# Altium schematic sheet SOM.SchDoc
size A3; SheetNumber: 8; SheetTotal: 11
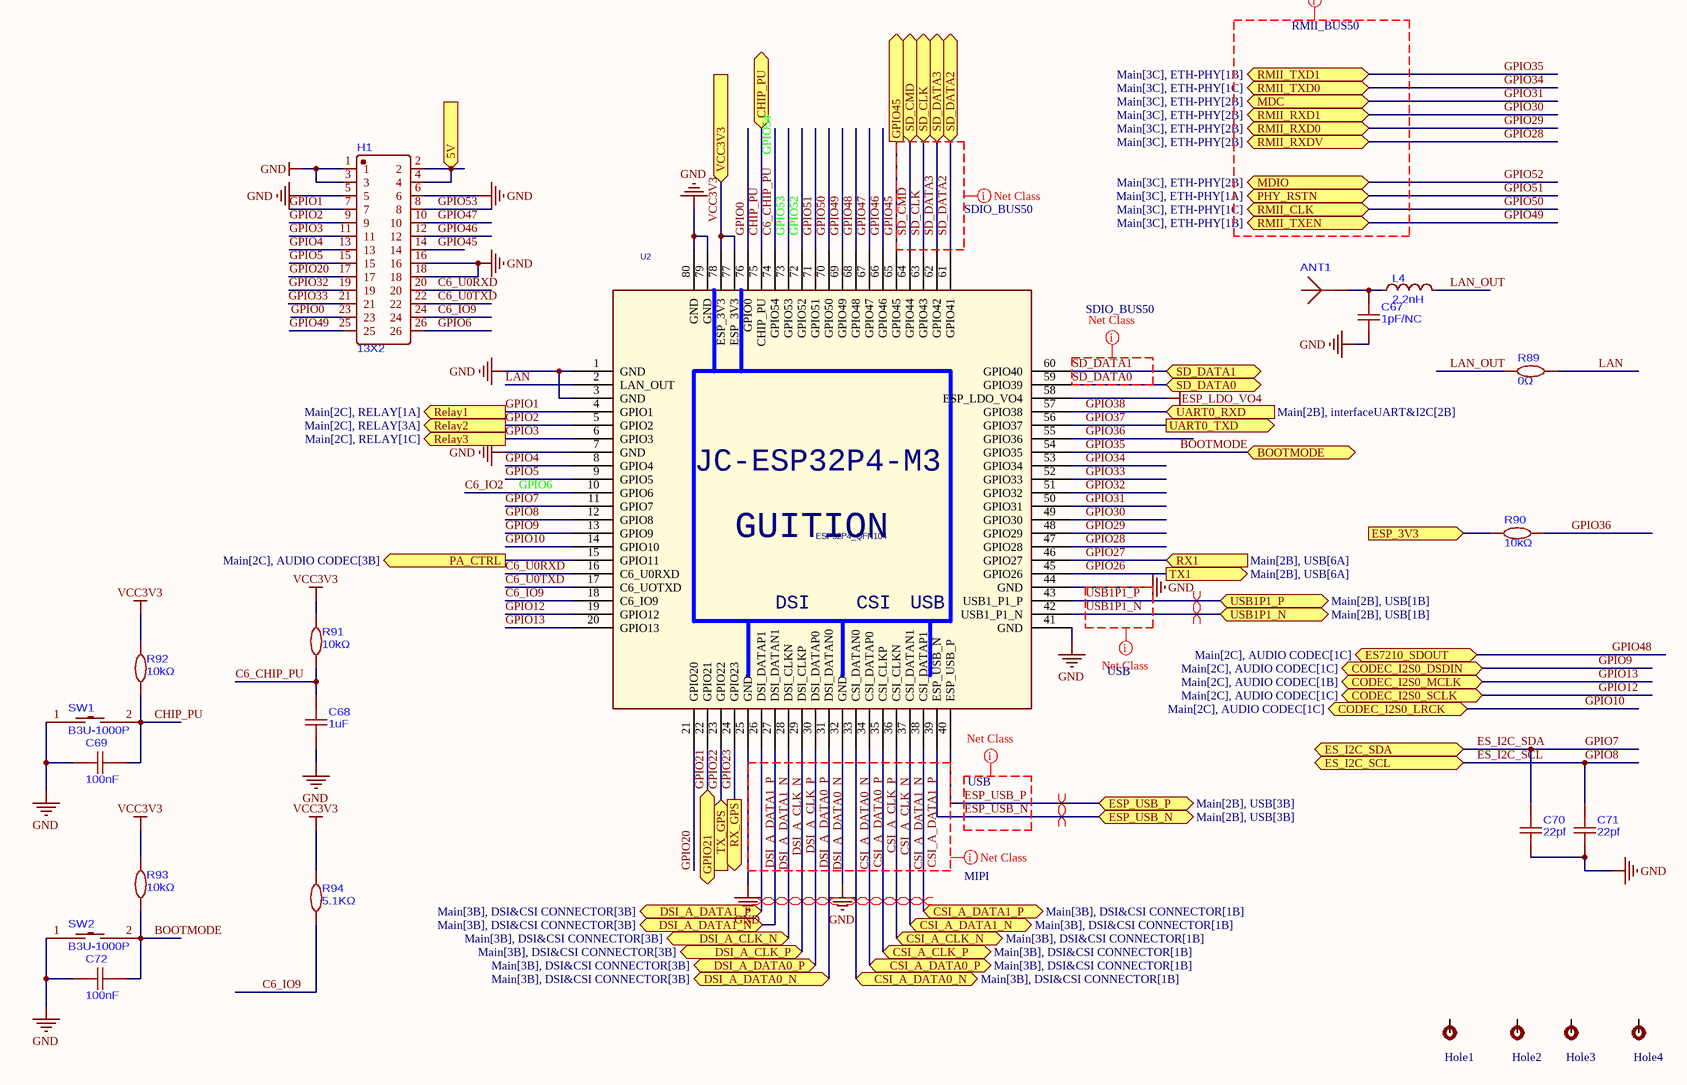
[diagram p0: SOM.SchDoc]

## Parts
ANT1  RF ANT 2450MHz CERAMIC SMD  [ANT-SMD-2_L3.2-W1.6-C504002]  (value not drawn)
C67  1pF/NC  [C0603]
C68  1uF  [C0603]
C69  100nF  [C0603]
C70  22pf  [C0603]
C71  22pf  [C0603]
C72  100nF  [C0603]
H1  13X2  [HDR-TH_26P-P2.54-V-M-R2-C13-S2.54]
Hole1  Pad Big  [Screw 3.0]  (value not drawn)
Hole2  Pad Big  [Screw 3.0]  (value not drawn)
Hole3  Pad Big  [Screw 3.0]  (value not drawn)
Hole4  Pad Big  [Screw 3.0]  (value not drawn)
L4  2.2nH  [C0603]
R89  0Ω  [R0603]
R90  10kΩ  [R0603]
R91  10kΩ  [R0603]
R92  10kΩ  [R0603]
R93  10kΩ  [R0603]
R94  5.1KΩ  [R0603]
SW1  B3U-1000P  [KEY-SMD_B3U-1000PM]
SW2  B3U-1000P  [KEY-SMD_B3U-1000PM]
U2  ESP32P4_QFN104  [JC-ESP32P4-M3_V0.2]

## Ports
5V (in, see Main[2A], interfaceUART&I2C[2B], Power[3C], RELAY[1A], USB[2D]), BOOTMODE (bidir, see Main[2B], USB[5C]), CHIP_PU (bidir, see Main[2B], USB[4C]), CODEC_I2S0_DSDIN (bidir, see Main[2C], AUDIO CODEC[1C]), CODEC_I2S0_LRCK (bidir, see Main[2C], AUDIO CODEC[1C]), CODEC_I2S0_MCLK (bidir, see Main[2C], AUDIO CODEC[1B]), CODEC_I2S0_SCLK (bidir, see Main[2C], AUDIO CODEC[1C]), CSI_A_CLK_N (bidir, see Main[3B], DSI&CSI CONNECTOR[1B]), CSI_A_CLK_P (bidir, see Main[3B], DSI&CSI CONNECTOR[1B]), CSI_A_DATA0_N (bidir, see Main[3B], DSI&CSI CONNECTOR[1B]), CSI_A_DATA0_P (bidir, see Main[3B], DSI&CSI CONNECTOR[1B]), CSI_A_DATA1_N (bidir, see Main[3B], DSI&CSI CONNECTOR[1B]), CSI_A_DATA1_P (bidir, see Main[3B], DSI&CSI CONNECTOR[1B]), DSI_A_CLK_N (bidir, see Main[3B], DSI&CSI CONNECTOR[3B]), DSI_A_CLK_P (bidir, see Main[3B], DSI&CSI CONNECTOR[3B]), DSI_A_DATA0_N (bidir, see Main[3B], DSI&CSI CONNECTOR[3B]), DSI_A_DATA0_P (bidir, see Main[3B], DSI&CSI CONNECTOR[3B]), DSI_A_DATA1_N (bidir, see Main[3B], DSI&CSI CONNECTOR[3B]), DSI_A_DATA1_P (bidir, see Main[3B], DSI&CSI CONNECTOR[3B]), ES7210_SDOUT (bidir, see Main[2C], AUDIO CODEC[1C]), ES_I2C_SCL (bidir, see Main[2B], AUDIO CODEC[1B], DSI&CSI CONNECTOR[2C], interfaceUART&I2C[2C]), ES_I2C_SDA (bidir, see Main[2B], AUDIO CODEC[1A], DSI&CSI CONNECTOR[2C], interfaceUART&I2C[2C]), ESP_3V3 (in, see Main[2A], DSI&CSI CONNECTOR[3C], ETH-PHY[2A], interfaceUART&I2C[1C], Power[4C]), ESP_USB_N (bidir, see Main[2B], USB[3B]), ESP_USB_P (bidir, see Main[2B], USB[3B]), GPIO21 (bidir, see Main[3C], SENSOR[4B]), GPIO45 (out, see Main[3A], MICROSD CARD[1B]), MDC (bidir, see Main[3C], ETH-PHY[2B]), MDIO (bidir, see Main[3C], ETH-PHY[2B]), PA_CTRL (out, see Main[2C], AUDIO CODEC[3B]), PHY_RSTN (bidir, see Main[3C], ETH-PHY[1A]), Relay1 (out, see Main[2C], RELAY[1A]), Relay2 (out, see Main[2C], RELAY[3A]), Relay3 (out, see Main[2C], RELAY[1C]), RMII_CLK (bidir, see Main[3C], ETH-PHY[1C]), RMII_RXD0 (bidir, see Main[3C], ETH-PHY[2B]), RMII_RXD1 (bidir, see Main[3C], ETH-PHY[2B]), RMII_RXDV (bidir, see Main[3C], ETH-PHY[2B]), RMII_TXD0 (bidir, see Main[3C], ETH-PHY[1C]), RMII_TXD1 (bidir, see Main[3C], ETH-PHY[1B]), RMII_TXEN (bidir, see Main[3C], ETH-PHY[1B]), RX1 (in, see Main[2B], USB[6A]), RX_GPS (out, see Main[3C], SENSOR[2B]), SD_CLK (bidir, see Main[3A], MICROSD CARD[2B]), SD_CMD (bidir, see Main[3A], MICROSD CARD[2B]), SD_DATA0 (bidir, see Main[3A], MICROSD CARD[2C]), SD_DATA1 (bidir, see Main[3A], MICROSD CARD[2C]), SD_DATA2 (bidir, see Main[3A], MICROSD CARD[2B]), SD_DATA3 (bidir, see Main[3A], MICROSD CARD[2B]), TX1 (out, see Main[2B], USB[6A]), TX_GPS (in, see Main[3C], SENSOR[2B]), UART0_RXD (in, see Main[2B], interfaceUART&I2C[2B]), UART0_TXD (out, see Main[2B], interfaceUART&I2C[1B], USB[2C]), USB1P1_N (bidir, see Main[2B], USB[1B]), USB1P1_P (bidir, see Main[2B], USB[1B]), VCC3V3 (in, see Main[2A], AUDIO CODEC[2C], Power[4C], SENSOR[3A], USB[4C])

## Nets
ESP_LDO_VO4: U2.58(ESP_LDO_VO4)
GND: C67.1 C68.1 C69.2 C70.1 C71.1 C72.2 H1.1 H1.3 H1.5 H1.6 H1.16 H1.18 SW1.1 SW2.1 U2.1(GND) U2.3(GND) U2.7(GND) U2.25(GND) U2.32(GND) U2.41(GND) U2.44(GND) U2.79(GND) U2.80(GND)
VCC3V3: R91.2 R92.2 R93.2 R94.2 U2.77(ESP_3V3) U2.78(ESP_3V3) ; port VCC3V3
5V: H1.2 H1.4 ; port 5V
BOOTMODE: C72.1 R93.1 SW2.2 U2.54(GPIO35) ; port BOOTMODE, port RMII_TXD1  [also labelled GPIO35]
C6_CHIP_PU: C68.2 R91.1 U2.74(GPIO54)  [also labelled GPIO54]
C6_IO2: H1.26 U2.10(GPIO6)  [also labelled GPIO6]
C6_IO9: H1.24 R94.1 U2.18(C6_IO9)
C6_U0RXD: H1.20 U2.16(C6_U0RXD)
C6_U0TXD: H1.22 U2.17(C6_UOTXD)
CHIP_PU: C69.1 R92.1 SW1.2 U2.75(CHIP_PU) ; port CHIP_PU
CSI_A_CLK_N: U2.36(CSI_CLKN) ; port CSI_A_CLK_N
CSI_A_CLK_P: U2.35(CSI_CLKP) ; port CSI_A_CLK_P
CSI_A_DATA0_N: U2.33(CSI_DATAN0) ; port CSI_A_DATA0_N
CSI_A_DATA0_P: U2.34(CSI_DATAP0) ; port CSI_A_DATA0_P
CSI_A_DATA1_N: U2.37(CSI_DATAN1) ; port CSI_A_DATA1_N
CSI_A_DATA1_P: U2.38(CSI_DATAP1) ; port CSI_A_DATA1_P
DSI_A_CLK_N: U2.28(DSI_CLKN) ; port DSI_A_CLK_N
DSI_A_CLK_P: U2.29(DSI_CLKP) ; port DSI_A_CLK_P
DSI_A_DATA0_N: U2.31(DSI_DATAN0) ; port DSI_A_DATA0_N
DSI_A_DATA0_P: U2.30(DSI_DATAP0) ; port DSI_A_DATA0_P
DSI_A_DATA1_N: U2.27(DSI_DATAN1) ; port DSI_A_DATA1_N
DSI_A_DATA1_P: U2.26(DSI_DATAP1) ; port DSI_A_DATA1_P
ES_I2C_SCL: C71.2 U2.12(GPIO8) ; port ES_I2C_SCL  [also labelled GPIO8]
ES_I2C_SDA: C70.2 U2.11(GPIO7) ; port ES_I2C_SDA  [also labelled GPIO7]
ESP_3V3: R90.1 ; port ESP_3V3
ESP_USB_N: U2.39(ESP_USB_N) ; port ESP_USB_N
ESP_USB_P: U2.40(ESP_USB_P) ; port ESP_USB_P
GPIO0: H1.23 U2.76(GPIO0)
GPIO1: H1.7 U2.4(GPIO1) ; port Relay1
GPIO2: H1.9 U2.5(GPIO2) ; port Relay2
GPIO3: H1.11 U2.6(GPIO3) ; port Relay3
GPIO4: H1.13 U2.8(GPIO4)
GPIO5: H1.15 U2.9(GPIO5)
GPIO9: U2.13(GPIO9) ; port CODEC_I2S0_DSDIN
GPIO10: U2.14(GPIO10) ; port CODEC_I2S0_LRCK
GPIO12: U2.19(GPIO12) ; port CODEC_I2S0_SCLK
GPIO13: U2.20(GPIO13) ; port CODEC_I2S0_MCLK
GPIO20: H1.17 U2.21(GPIO20)
GPIO21: U2.22(GPIO21) ; port GPIO21
GPIO22: U2.23(GPIO22) ; port TX_GPS
GPIO23: U2.24(GPIO23) ; port RX_GPS
GPIO26: U2.45(GPIO26) ; port TX1
GPIO27: U2.46(GPIO27) ; port RX1
GPIO28: U2.47(GPIO28) ; port RMII_RXDV
GPIO29: U2.48(GPIO29) ; port RMII_RXD0
GPIO30: U2.49(GPIO30) ; port RMII_RXD1
GPIO31: U2.50(GPIO31) ; port MDC
GPIO32: H1.19 U2.51(GPIO32)
GPIO33: H1.21 U2.52(GPIO33)
GPIO34: U2.53(GPIO34) ; port RMII_TXD0
GPIO36: R90.2 U2.55(GPIO36)
GPIO37: U2.56(GPIO37) ; port UART0_TXD
GPIO38: U2.57(GPIO38) ; port UART0_RXD
GPIO45: H1.14 U2.65(GPIO45) ; port GPIO45
GPIO46: H1.12 U2.66(GPIO46)
GPIO47: H1.10 U2.67(GPIO47)
GPIO48: U2.68(GPIO48) ; port ES7210_SDOUT
GPIO49: H1.25 U2.69(GPIO49) ; port RMII_TXEN
GPIO50: U2.70(GPIO50) ; port RMII_CLK
GPIO51: U2.71(GPIO51) ; port PHY_RSTN
GPIO52: U2.72(GPIO52) ; port MDIO
GPIO53: H1.8 U2.73(GPIO53)
LAN: R89.2 U2.2(LAN_OUT)
LAN_OUT: L4.2 R89.1
PA_CTRL: U2.15(GPIO11) ; port PA_CTRL
SD_CLK: U2.63(GPIO43) ; port SD_CLK
SD_CMD: U2.64(GPIO44) ; port SD_CMD
SD_DATA0: U2.59(GPIO39) ; port SD_DATA0
SD_DATA1: U2.60(GPIO40) ; port SD_DATA1
SD_DATA2: U2.61(GPIO41) ; port SD_DATA2
SD_DATA3: U2.62(GPIO42) ; port SD_DATA3
USB1P1_N: U2.42(USB1_P1_N) ; port USB1P1_N
USB1P1_P: U2.43(USB1_P1_P) ; port USB1P1_P
NetANT1_2: ANT1.2 C67.2 L4.1

Not connected (* = marked no-connect by the designer): ANT1 1(ANT); Hole1 1; Hole2 1; Hole3 1; Hole4 1

## Layout directives
net class USB: ESP_USB_N, ESP_USB_P, GND, USB1P1_N, USB1P1_P
differential pair; net class DIFF90; differential pair class DIFF90: ESP_USB_N, ESP_USB_P, USB1P1_N, USB1P1_P
net class MIPI: CSI_A_CLK_N, CSI_A_CLK_P, CSI_A_DATA0_N, CSI_A_DATA0_P, CSI_A_DATA1_N, CSI_A_DATA1_P, DSI_A_CLK_N, DSI_A_CLK_P, DSI_A_DATA0_N, DSI_A_DATA0_P, DSI_A_DATA1_N, DSI_A_DATA1_P
differential pair; net class DIFF100; differential pair class DIFF100: CSI_A_CLK_N, CSI_A_CLK_P, CSI_A_DATA0_N, CSI_A_DATA0_P, CSI_A_DATA1_N, CSI_A_DATA1_P, DSI_A_CLK_N, DSI_A_CLK_P, DSI_A_DATA0_N, DSI_A_DATA0_P, DSI_A_DATA1_N, DSI_A_DATA1_P
net class SDIO_BUS50: GPIO45, SD_CLK, SD_CMD, SD_DATA0, SD_DATA1, SD_DATA2, SD_DATA3
net class RMII_BUS50: (no net found under the mark)

## Notes on the sheet
- (in symbol JC-ESP32P4-M3) GUITION; DSI; CSI; USB

## Library data of the parts
ANT1 = kinghelm KH-3216-A35: Ceramic Antenna 5.19dBi 100MHz 2.45GHz 1206 RF Antennas RoHS
C67 = FCC0603N1R0C500CT: 50V 1pF C0G 0603 Ceramic Capacitors RoHS
C68 = CL10B105KA8NNNC: 25V 1uF X7R ±10% 0603 Ceramic Capacitors ROHS
C69 C72 = CC0603KRX7R9BB104: 50V 100nF X7R ±10% 0603 Ceramic Capacitors ROHS
C70 C71 = CL10C220JB8NNNC: 50V 22pF C0G ±5% 0603 Ceramic Capacitors RoHS
H1 = HX PZ2.54-2X13P ZZ: 26P 2x13P Gold Copper Alloy -40℃~+105℃ Pin Header Black 2.54mm 2.5mm 6mm 1kV 3mm 3A 2 Through Hole 2.54mm Through Hole,P=2.54mm Headers, Male Pins RoHS
Hole1-Hole4 = Pad_Big: Value: Pad Big - Hole
L4 = MQG06HF2N2JT7: 700mA 2.2nH ±5% Wirewound Chip Inductor 80mΩ 0603 Fixed Inductors RoHS
R89 = RC0603JR-070RL: 100mW 0Ω 75V Thick Film Resistor ±5% 0603 Chip Resistor - Surface Mount RoHS
R90-R93 = RC0603FR-0710KL: 100mW 10kΩ 75V ±100ppm/℃ Thick Film Resistor ±1% 0603 Chip Resistor - Surface Mount ROHS
R94 = FRC0603F5101TS: 100mW 5.1kΩ 75V ±100ppm/℃ Thick Film Resistor ±1% 0603 Chip Resistor - Surface Mount RoHS
SW1 SW2 = B3U-1000P: 12V 2.5mm Round Button 3mm SPST 50mA SMD,3x2.5mm Tactile Switches ROHS
U2 = JC-ESP32P4-M3